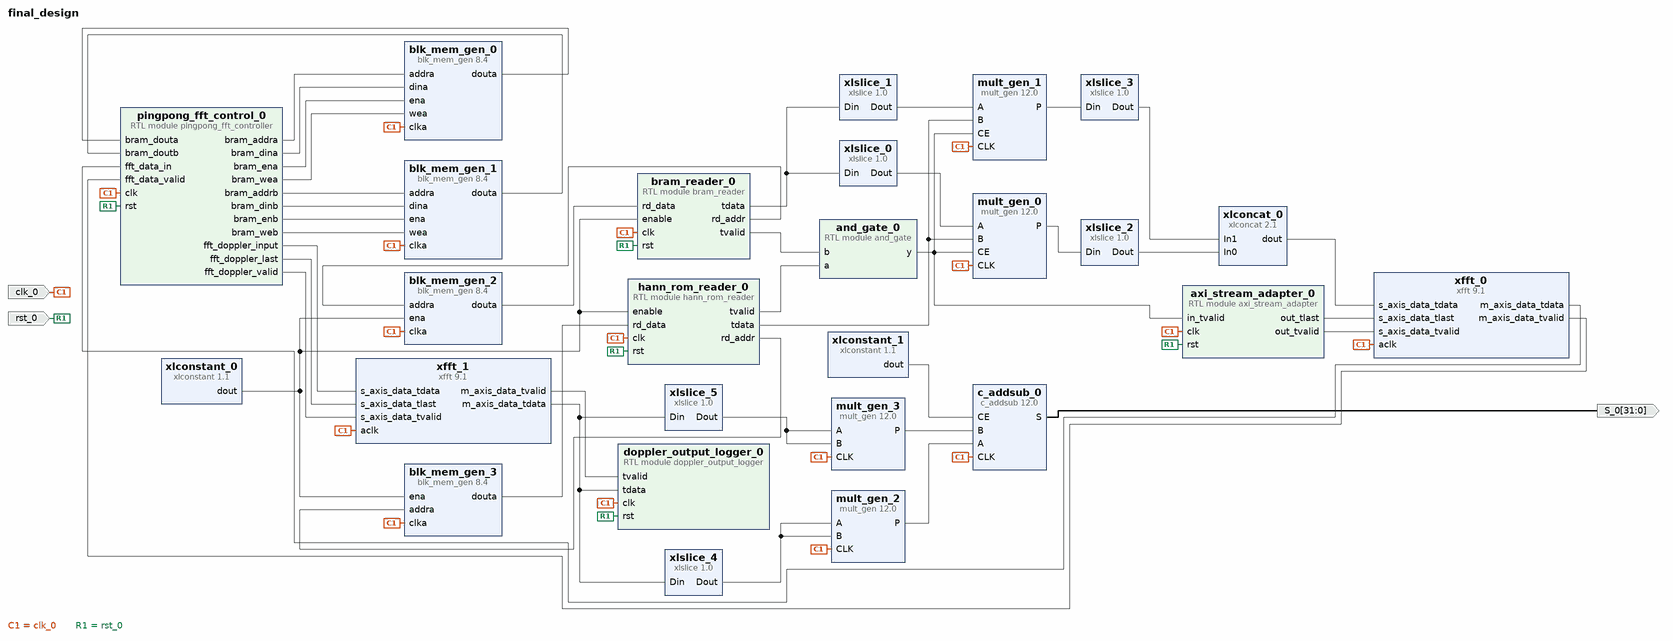
[diagram p0: block diagram of the top level]
# Vivado block design final_design, xczu7ev-ffvc1156-2-e, Vivado 2024.2
create_bd_design final_design

create_bd_port -dir I -type clk clk_0
create_bd_port -dir I -type rst rst_0
create_bd_port -dir O -from 31 -to 0 -type data S_0

create_bd_cell -type ip -vlnv xilinx.com:ip:xlconstant:1.1 xlconstant_0
create_bd_cell -type ip -vlnv xilinx.com:ip:xlslice:1.0 xlslice_0
set_property -dict {CONFIG.DIN_FROM 31 CONFIG.DIN_TO 16 CONFIG.DOUT_WIDTH 16} [get_bd_cells xlslice_0]
create_bd_cell -type ip -vlnv xilinx.com:ip:xlslice:1.0 xlslice_1
set_property -dict {CONFIG.DIN_FROM 15 CONFIG.DOUT_WIDTH 16} [get_bd_cells xlslice_1]
create_bd_cell -type ip -vlnv xilinx.com:ip:mult_gen:12.0 mult_gen_0
set_property -dict [list \
  CONFIG.ClockEnable true \
  CONFIG.OutputWidthHigh 31 \
  CONFIG.PipeStages 4 \
  CONFIG.PortAType Signed \
  CONFIG.PortAWidth 16 \
  CONFIG.PortBWidth 16 \
  CONFIG.Use_Custom_Output_Width true \
] [get_bd_cells mult_gen_0]
create_bd_cell -type ip -vlnv xilinx.com:ip:mult_gen:12.0 mult_gen_1
set_property -dict [list \
  CONFIG.ClockEnable true \
  CONFIG.OutputWidthHigh 31 \
  CONFIG.PipeStages 4 \
  CONFIG.PortAType Signed \
  CONFIG.PortAWidth 16 \
  CONFIG.PortBWidth 16 \
  CONFIG.Use_Custom_Output_Width true \
] [get_bd_cells mult_gen_1]
create_bd_cell -type module -reference and_gate and_gate_0
create_bd_cell -type ip -vlnv xilinx.com:ip:xlslice:1.0 xlslice_2
set_property -dict {CONFIG.DIN_FROM 30 CONFIG.DIN_TO 15 CONFIG.DOUT_WIDTH 16} [get_bd_cells xlslice_2]
create_bd_cell -type ip -vlnv xilinx.com:ip:xlslice:1.0 xlslice_3
set_property -dict {CONFIG.DIN_FROM 30 CONFIG.DIN_TO 15 CONFIG.DOUT_WIDTH 16} [get_bd_cells xlslice_3]
create_bd_cell -type ip -vlnv xilinx.com:ip:xlconcat:2.1 xlconcat_0
set_property -dict {CONFIG.IN0_WIDTH 16 CONFIG.IN1_WIDTH 16 CONFIG.dout_width 32} [get_bd_cells xlconcat_0]
create_bd_cell -type module -reference axi_stream_adapter axi_stream_adapter_0
create_bd_cell -type ip -vlnv xilinx.com:ip:xfft:9.1 xfft_0
set_property -dict [list \
  CONFIG.complex_mult_type use_mults_performance \
  CONFIG.implementation_options pipelined_streaming_io \
  CONFIG.number_of_stages_using_block_ram_for_data_and_phase_factors 0 \
  CONFIG.output_ordering natural_order \
  CONFIG.target_clock_frequency 10 \
  CONFIG.transform_length 128 \
] [get_bd_cells xfft_0]
create_bd_cell -type module -reference pingpong_fft_controller pingpong_fft_control_0
create_bd_cell -type ip -vlnv xilinx.com:ip:blk_mem_gen:8.4 blk_mem_gen_0
set_property -dict {CONFIG.Write_Depth_A 32768 CONFIG.use_bram_block Stand_Alone} [get_bd_cells blk_mem_gen_0]
create_bd_cell -type ip -vlnv xilinx.com:ip:blk_mem_gen:8.4 blk_mem_gen_1
set_property -dict {CONFIG.Write_Depth_A 32768 CONFIG.use_bram_block Stand_Alone} [get_bd_cells blk_mem_gen_1]
create_bd_cell -type ip -vlnv xilinx.com:ip:xfft:9.1 xfft_1
set_property -dict [list \
  CONFIG.complex_mult_type use_mults_performance \
  CONFIG.implementation_options pipelined_streaming_io \
  CONFIG.number_of_stages_using_block_ram_for_data_and_phase_factors 1 \
  CONFIG.output_ordering natural_order \
  CONFIG.target_clock_frequency 10 \
  CONFIG.transform_length 256 \
] [get_bd_cells xfft_1]
create_bd_cell -type module -reference doppler_output_logger doppler_output_logger_0
create_bd_cell -type ip -vlnv xilinx.com:ip:xlslice:1.0 xlslice_4
set_property -dict {CONFIG.DIN_FROM 31 CONFIG.DIN_TO 16 CONFIG.DOUT_WIDTH 16} [get_bd_cells xlslice_4]
create_bd_cell -type ip -vlnv xilinx.com:ip:xlslice:1.0 xlslice_5
set_property -dict {CONFIG.DIN_FROM 15 CONFIG.DIN_TO 0 CONFIG.DOUT_WIDTH 16} [get_bd_cells xlslice_5]
create_bd_cell -type ip -vlnv xilinx.com:ip:mult_gen:12.0 mult_gen_2
set_property -dict {CONFIG.PipeStages 4 CONFIG.PortAWidth 16 CONFIG.PortBWidth 16} [get_bd_cells mult_gen_2]
create_bd_cell -type ip -vlnv xilinx.com:ip:mult_gen:12.0 mult_gen_3
set_property -dict {CONFIG.PipeStages 4 CONFIG.PortAWidth 16 CONFIG.PortBWidth 16} [get_bd_cells mult_gen_3]
create_bd_cell -type ip -vlnv xilinx.com:ip:c_addsub:12.0 c_addsub_0
set_property -dict [list \
  CONFIG.A_Width 32 \
  CONFIG.B_Value 00000000000000000000000000000000 \
  CONFIG.B_Width 32 \
  CONFIG.Latency 1 \
  CONFIG.Out_Width 32 \
] [get_bd_cells c_addsub_0]
create_bd_cell -type ip -vlnv xilinx.com:ip:xlconstant:1.1 xlconstant_1
create_bd_cell -type ip -vlnv xilinx.com:ip:blk_mem_gen:8.4 blk_mem_gen_2
set_property -dict [list \
  CONFIG.Coe_File ../../../../../../../adc_input_raw.coe \
  CONFIG.Fill_Remaining_Memory_Locations true \
  CONFIG.Load_Init_File true \
  CONFIG.Memory_Type Single_Port_ROM \
  CONFIG.Write_Depth_A 32768 \
  CONFIG.use_bram_block Stand_Alone \
] [get_bd_cells blk_mem_gen_2]
create_bd_cell -type module -reference bram_reader bram_reader_0
create_bd_cell -type ip -vlnv xilinx.com:ip:blk_mem_gen:8.4 blk_mem_gen_3
set_property -dict [list \
  CONFIG.Coe_File ../../../../../../../hann.coe \
  CONFIG.Load_Init_File true \
  CONFIG.Memory_Type Single_Port_ROM \
  CONFIG.Write_Depth_A 128 \
  CONFIG.use_bram_block Stand_Alone \
] [get_bd_cells blk_mem_gen_3]
create_bd_cell -type module -reference hann_rom_reader hann_rom_reader_0

# ---- connections ----

connect_bd_net [get_bd_pins and_gate_0/y] [get_bd_pins mult_gen_0/CE] [get_bd_pins mult_gen_1/CE] [get_bd_pins axi_stream_adapter_0/in_tvalid]
connect_bd_net [get_bd_pins axi_stream_adapter_0/out_tlast] [get_bd_pins xfft_0/s_axis_data_tlast]
connect_bd_net [get_bd_pins axi_stream_adapter_0/out_tvalid] [get_bd_pins xfft_0/s_axis_data_tvalid]
connect_bd_net [get_bd_pins blk_mem_gen_0/douta] [get_bd_pins pingpong_fft_control_0/bram_douta]
connect_bd_net [get_bd_pins blk_mem_gen_1/douta] [get_bd_pins pingpong_fft_control_0/bram_doutb]
connect_bd_net [get_bd_pins blk_mem_gen_2/douta] [get_bd_pins bram_reader_0/rd_data]
connect_bd_net [get_bd_pins blk_mem_gen_3/douta] [get_bd_pins hann_rom_reader_0/rd_data]
connect_bd_net [get_bd_pins bram_reader_0/rd_addr] [get_bd_pins blk_mem_gen_2/addra]
connect_bd_net [get_bd_pins bram_reader_0/tvalid] [get_bd_pins and_gate_0/b]
connect_bd_net [get_bd_pins c_addsub_0/S] [get_bd_ports S_0]
connect_bd_net -net clk_0_1 [get_bd_ports clk_0] \
  [get_bd_pins mult_gen_0/CLK] [get_bd_pins mult_gen_1/CLK] [get_bd_pins axi_stream_adapter_0/clk] [get_bd_pins xfft_0/aclk] \
  [get_bd_pins blk_mem_gen_0/clka] [get_bd_pins blk_mem_gen_1/clka] [get_bd_pins xfft_1/aclk] \
  [get_bd_pins doppler_output_logger_0/clk] [get_bd_pins mult_gen_2/CLK] [get_bd_pins mult_gen_3/CLK] \
  [get_bd_pins c_addsub_0/CLK] [get_bd_pins pingpong_fft_control_0/clk] [get_bd_pins blk_mem_gen_2/clka] \
  [get_bd_pins blk_mem_gen_3/clka] [get_bd_pins hann_rom_reader_0/clk] [get_bd_pins bram_reader_0/clk]
connect_bd_net -net frame_streamer_0_tdata [get_bd_pins bram_reader_0/tdata] [get_bd_pins xlslice_0/Din] [get_bd_pins xlslice_1/Din]
connect_bd_net [get_bd_pins hann_rom_reader_0/rd_addr] [get_bd_pins blk_mem_gen_3/addra]
connect_bd_net [get_bd_pins hann_rom_reader_0/tvalid] [get_bd_pins and_gate_0/a]
connect_bd_net -net hann_window_0_hann_coeff [get_bd_pins hann_rom_reader_0/tdata] [get_bd_pins mult_gen_0/B] [get_bd_pins mult_gen_1/B]
connect_bd_net [get_bd_pins mult_gen_0/P] [get_bd_pins xlslice_2/Din]
connect_bd_net [get_bd_pins mult_gen_1/P] [get_bd_pins xlslice_3/Din]
connect_bd_net [get_bd_pins mult_gen_2/P] [get_bd_pins c_addsub_0/A]
connect_bd_net [get_bd_pins mult_gen_3/P] [get_bd_pins c_addsub_0/B]
connect_bd_net [get_bd_pins pingpong_fft_control_0/bram_addra] [get_bd_pins blk_mem_gen_0/addra]
connect_bd_net [get_bd_pins pingpong_fft_control_0/bram_addrb] [get_bd_pins blk_mem_gen_1/addra]
connect_bd_net [get_bd_pins pingpong_fft_control_0/bram_dina] [get_bd_pins blk_mem_gen_0/dina]
connect_bd_net [get_bd_pins pingpong_fft_control_0/bram_dinb] [get_bd_pins blk_mem_gen_1/dina]
connect_bd_net [get_bd_pins pingpong_fft_control_0/bram_ena] [get_bd_pins blk_mem_gen_0/ena]
connect_bd_net [get_bd_pins pingpong_fft_control_0/bram_enb] [get_bd_pins blk_mem_gen_1/ena]
connect_bd_net [get_bd_pins pingpong_fft_control_0/bram_wea] [get_bd_pins blk_mem_gen_0/wea]
connect_bd_net [get_bd_pins pingpong_fft_control_0/bram_web] [get_bd_pins blk_mem_gen_1/wea]
connect_bd_net [get_bd_pins pingpong_fft_control_0/fft_doppler_input] [get_bd_pins xfft_1/s_axis_data_tdata]
connect_bd_net [get_bd_pins pingpong_fft_control_0/fft_doppler_last] [get_bd_pins xfft_1/s_axis_data_tlast]
connect_bd_net [get_bd_pins pingpong_fft_control_0/fft_doppler_valid] [get_bd_pins xfft_1/s_axis_data_tvalid]
connect_bd_net -net rst_0_1 [get_bd_ports rst_0] \
  [get_bd_pins axi_stream_adapter_0/rst] [get_bd_pins doppler_output_logger_0/rst] [get_bd_pins pingpong_fft_control_0/rst] \
  [get_bd_pins hann_rom_reader_0/rst] [get_bd_pins bram_reader_0/rst]
connect_bd_net [get_bd_pins xfft_0/m_axis_data_tdata] [get_bd_pins pingpong_fft_control_0/fft_data_in]
connect_bd_net [get_bd_pins xfft_0/m_axis_data_tvalid] [get_bd_pins pingpong_fft_control_0/fft_data_valid]
connect_bd_net [get_bd_pins xfft_1/m_axis_data_tdata] \
  [get_bd_pins doppler_output_logger_0/tdata] [get_bd_pins xlslice_4/Din] [get_bd_pins xlslice_5/Din]
connect_bd_net [get_bd_pins xfft_1/m_axis_data_tvalid] [get_bd_pins doppler_output_logger_0/tvalid]
connect_bd_net [get_bd_pins xlconcat_0/dout] [get_bd_pins xfft_0/s_axis_data_tdata]
connect_bd_net [get_bd_pins xlconstant_0/dout] \
  [get_bd_pins blk_mem_gen_2/ena] [get_bd_pins blk_mem_gen_3/ena] [get_bd_pins hann_rom_reader_0/enable] \
  [get_bd_pins bram_reader_0/enable]
connect_bd_net [get_bd_pins xlconstant_1/dout] [get_bd_pins c_addsub_0/CE]
connect_bd_net [get_bd_pins xlslice_0/Dout] [get_bd_pins mult_gen_0/A]
connect_bd_net [get_bd_pins xlslice_1/Dout] [get_bd_pins mult_gen_1/A]
connect_bd_net [get_bd_pins xlslice_2/Dout] [get_bd_pins xlconcat_0/In0]
connect_bd_net [get_bd_pins xlslice_3/Dout] [get_bd_pins xlconcat_0/In1]
connect_bd_net [get_bd_pins xlslice_4/Dout] [get_bd_pins mult_gen_2/A] [get_bd_pins mult_gen_2/B]
connect_bd_net [get_bd_pins xlslice_5/Dout] [get_bd_pins mult_gen_3/A] [get_bd_pins mult_gen_3/B]

validate_bd_design
save_bd_design
